# Altium schematic sheet MAIN.SchDoc
size A4
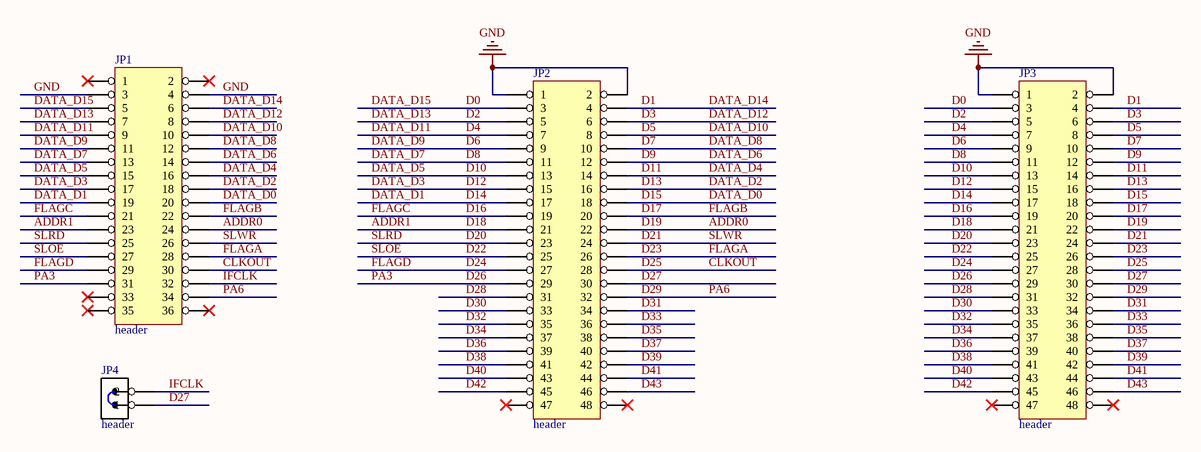
[diagram p0: MAIN.SchDoc]

## Parts
JP1  header  [header2X18]
JP2  header  [header2X24]
JP3  header  [header2X24]
JP4  header  [header2]

## Nets
GND: JP1.3 JP1.4 JP2.1 JP2.2 JP3.1 JP3.2
ADDR0: JP1.24 JP2.22 JP3.22  [also labelled D19]
ADDR1: JP1.23 JP2.21 JP3.21  [also labelled D18]
CLKOUT: JP1.30 JP2.28 JP3.28  [also labelled D25]
D0: JP1.5 JP2.3 JP3.3  [also labelled DATA_D15]
D1: JP1.6 JP2.4 JP3.4  [also labelled DATA_D14]
D2: JP1.7 JP2.5 JP3.5  [also labelled DATA_D13]
D3: JP1.8 JP2.6 JP3.6  [also labelled DATA_D12]
D4: JP1.9 JP2.7 JP3.7  [also labelled DATA_D11]
D5: JP1.10 JP2.8 JP3.8  [also labelled DATA_D10]
D6: JP1.11 JP2.9 JP3.9  [also labelled DATA_D9]
D7: JP1.12 JP2.10 JP3.10  [also labelled DATA_D8]
D8: JP1.13 JP2.11 JP3.11  [also labelled DATA_D7]
D9: JP1.14 JP2.12 JP3.12  [also labelled DATA_D6]
D10: JP1.15 JP2.13 JP3.13  [also labelled DATA_D5]
D11: JP1.16 JP2.14 JP3.14  [also labelled DATA_D4]
D12: JP1.17 JP2.15 JP3.15  [also labelled DATA_D3]
D13: JP1.18 JP2.16 JP3.16  [also labelled DATA_D2]
D14: JP1.19 JP2.17 JP3.17  [also labelled DATA_D1]
D15: JP1.20 JP2.18 JP3.18  [also labelled DATA_D0]
D16: JP1.21 JP2.19 JP3.19  [also labelled FLAGC]
D17: JP1.22 JP2.20 JP3.20  [also labelled FLAGB]
D20: JP1.25 JP2.23 JP3.23  [also labelled SLRD]
D21: JP1.26 JP2.24 JP3.24  [also labelled SLWR]
D22: JP1.27 JP2.25 JP3.25  [also labelled SLOE]
D23: JP1.28 JP2.26 JP3.26  [also labelled FLAGA]
D24: JP1.29 JP2.27 JP3.27  [also labelled FLAGD]
D26: JP1.31 JP2.29 JP3.29  [also labelled PA3]
D27: JP2.30 JP3.30 JP4.1
D28: JP2.31 JP3.31
D29: JP1.34 JP2.32 JP3.32  [also labelled PA6]
D30: JP2.33 JP3.33
D31: JP2.34 JP3.34
D32: JP2.35 JP3.35
D33: JP2.36 JP3.36
D34: JP2.37 JP3.37
D35: JP2.38 JP3.38
D36: JP2.39 JP3.39
D37: JP2.40 JP3.40
D38: JP2.41 JP3.41
D39: JP2.42 JP3.42
D40: JP2.43 JP3.43
D41: JP2.44 JP3.44
D42: JP2.45 JP3.45
D43: JP2.46 JP3.46
IFCLK: JP1.32 JP4.2

Not connected (* = marked no-connect by the designer): JP1 1* 2* 33* 35* 36*; JP2 47* 48*; JP3 47* 48*

## Library data of the parts
JP1 = HEADER 18X2
JP2 JP3 = HEADER 24X2
JP4 = HEADER 2